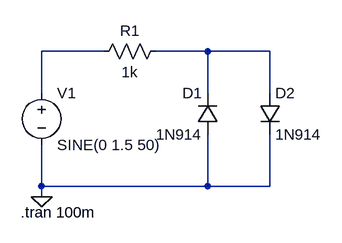
[diagram p0: schematic 4_1.asc]
4_1.asc, the LTspice schematic file:
Version 4
SHEET 1 880 680
WIRE 224 48 128 48
WIRE 384 48 304 48
WIRE 480 48 384 48
WIRE 128 112 128 48
WIRE 384 112 384 48
WIRE 480 112 480 48
WIRE 128 256 128 192
WIRE 384 256 384 176
WIRE 384 256 128 256
WIRE 480 256 480 176
WIRE 480 256 384 256
WIRE 128 272 128 256
FLAG 128 272 0
SYMBOL voltage 128 96 R0
WINDOW 123 0 0 Left 2
WINDOW 39 0 0 Left 2
SYMATTR InstName V1
SYMATTR Value SINE(0 1.5 50)
SYMBOL res 320 32 R90
WINDOW 0 0 56 VBottom 2
WINDOW 3 32 56 VTop 2
SYMATTR InstName R1
SYMATTR Value 1k
SYMBOL diode 400 176 R180
WINDOW 0 24 64 Left 2
WINDOW 3 24 0 Left 2
SYMATTR InstName D1
SYMATTR Value 1N914
SYMBOL diode 464 112 R0
SYMATTR InstName D2
SYMATTR Value 1N914
TEXT 96 296 Left 2 !.tran 100m

The netlist it stands for:
* 4_1.asc
V1 N001 0 SINE(0 1.5 50)
R1 N002 N001 1k
D1 0 N002 1N914
D2 N002 0 1N914
.model D D
.lib standard.dio
.tran 100m
.backanno
.end